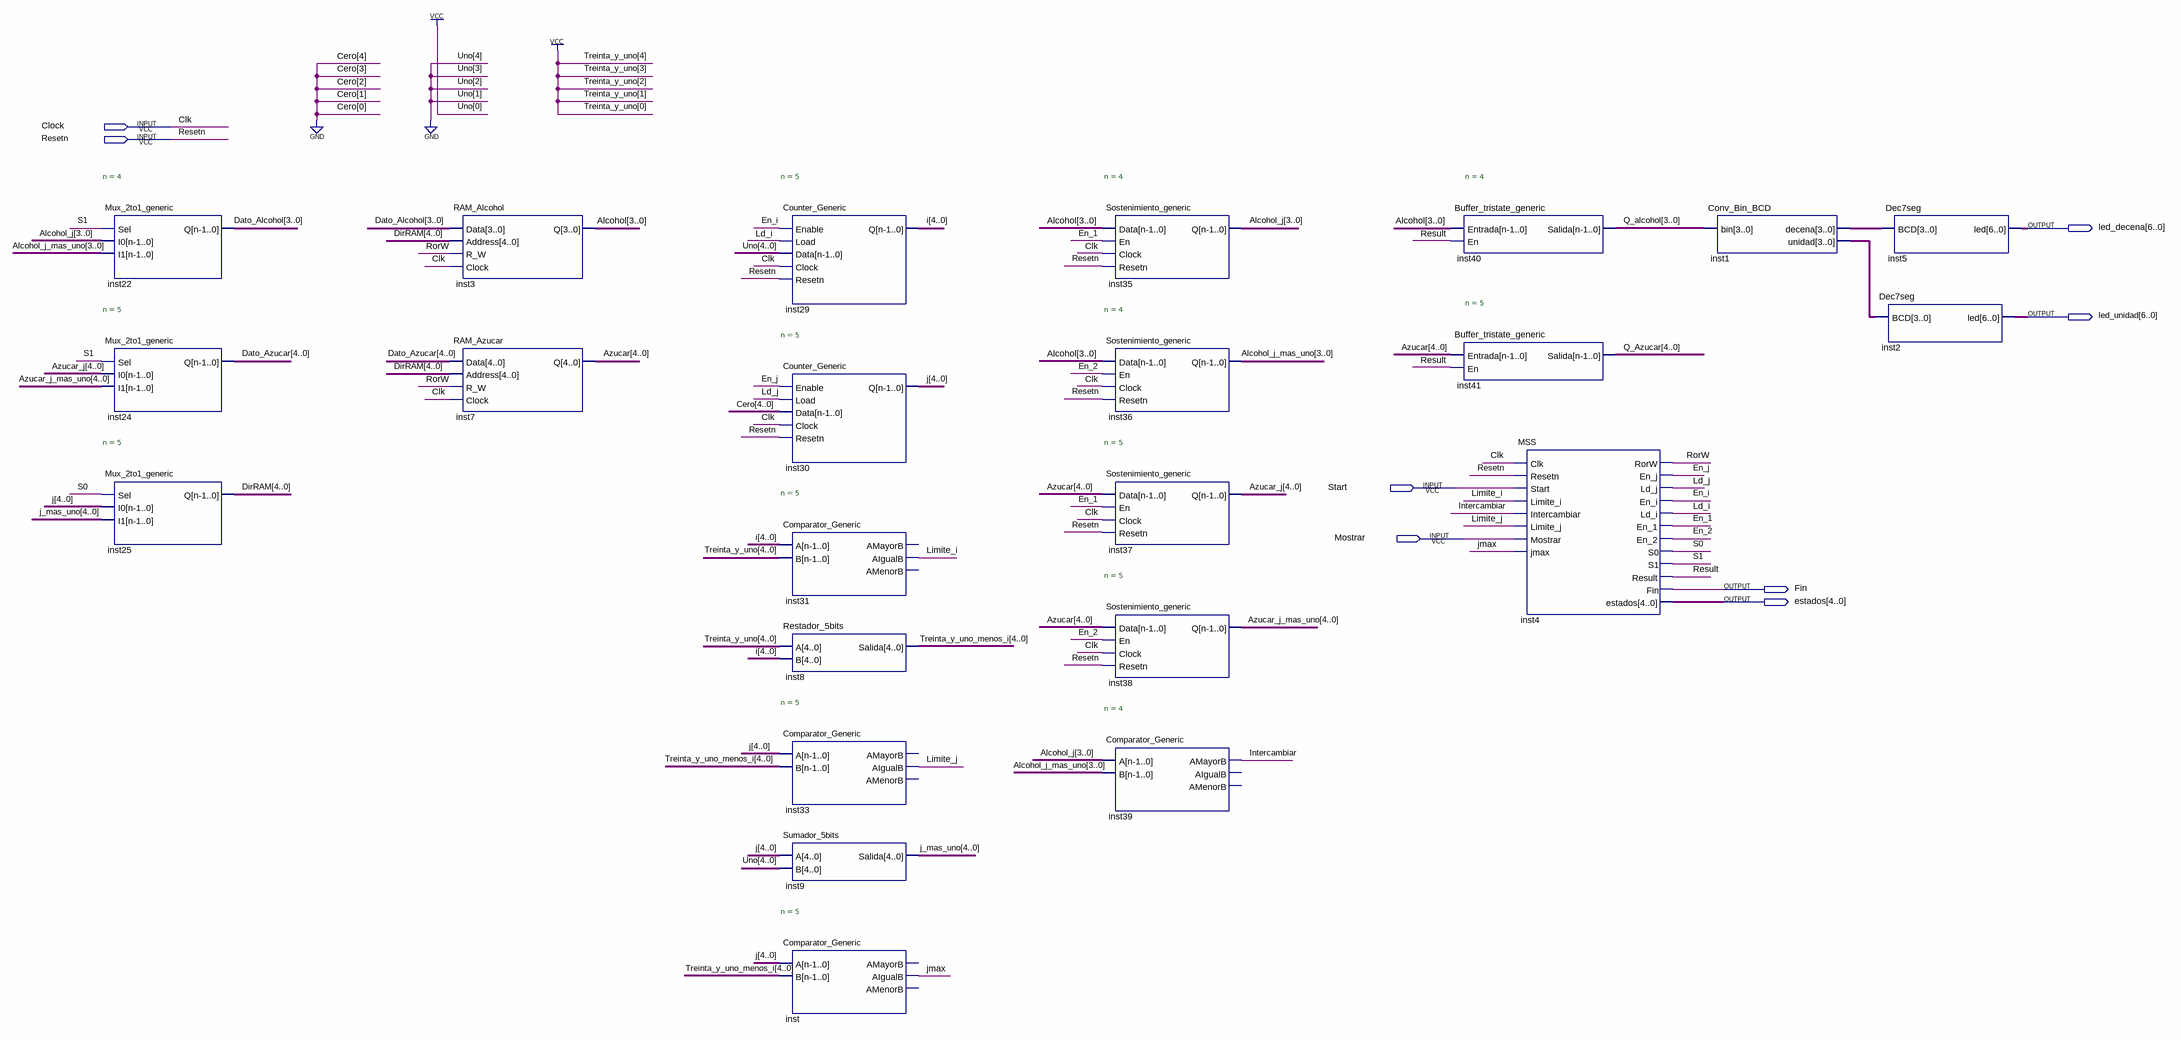
[diagram p0: schematic sheet]
// Quartus schematic Diagram.bdf as structural Verilog: 23 symbols, 8 pins
module Diagram (
  input  Clock,
  input  Resetn,
  input  Start,
  input  Mostrar,
  output [6:0] led_decena,
  output [6:0] led_unidad,
  output Fin,
  output [4:0] estados
);

  wire En_1, En_2, En_i, En_j, Intercambiar, jmax, Ld_i, Ld_j, Limite_i, Limite_j, Result, RorW, S0, S1;
  wire [3:0] Alcohol, Alcohol_j, Alcohol_j_mas_uno, Dato_Alcohol, inst1_decena, inst1_unidad, Q_alcohol;
  wire [4:0] Azucar, Azucar_j, Azucar_j_mas_uno, Dato_Azucar, DirRAM, i, j, j_mas_uno, Q_Azucar,
       Treinta_y_uno_menos_i;

  Mux_2to1_generic #(.n(4)) inst22 (.Sel(S1), .I0(Alcohol_j), .I1(Alcohol_j_mas_uno), .Q(Dato_Alcohol));
  Mux_2to1_generic #(.n(5)) inst24 (.Sel(S1), .I0(Azucar_j), .I1(Azucar_j_mas_uno), .Q(Dato_Azucar));
  Mux_2to1_generic #(.n(5)) inst25 (.Sel(S0), .I0(j), .I1(j_mas_uno), .Q(DirRAM));
  RAM_Alcohol inst3 (.Data(Dato_Alcohol), .Address(DirRAM), .R_W(RorW), .Clock(Clock), .Q(Alcohol));
  RAM_Azucar inst7 (.Data(Dato_Azucar), .Address(DirRAM), .R_W(RorW), .Clock(Clock), .Q(Azucar));
  Counter_Generic #(.n(5)) inst29 (.Enable(En_i), .Load(Ld_i), .Data(5'b00001), .Clock(Clock), .Resetn(Resetn), .Q(i));
  Counter_Generic #(.n(5)) inst30 (.Enable(En_j), .Load(Ld_j), .Data({5{1'b0}}), .Clock(Clock), .Resetn(Resetn), .Q(j));
  Comparator_Generic #(.n(5)) inst31 (.A(i), .B({5{1'b1}}), .AIgualB(Limite_i));  // open: AMayorB, AMenorB
  Restador_5bits inst8 (.A({5{1'b1}}), .B(i), .Salida(Treinta_y_uno_menos_i));
  Comparator_Generic #(.n(5)) inst33 (.A(j), .B(Treinta_y_uno_menos_i), .AIgualB(Limite_j));  // open: AMayorB, AMenorB
  Sumador_5bits inst9 (.A(j), .B(5'b00001), .Salida(j_mas_uno));
  Comparator_Generic #(.n(5)) inst (.A(j), .B(Treinta_y_uno_menos_i), .AIgualB(jmax));  // open: AMayorB, AMenorB
  Sostenimiento_generic #(.n(4)) inst35 (.Data(Alcohol), .En(En_1), .Clock(Clock), .Resetn(Resetn), .Q(Alcohol_j));
  Sostenimiento_generic #(.n(4)) inst36 (
    .Data(Alcohol), .En(En_2), .Clock(Clock), .Resetn(Resetn), .Q(Alcohol_j_mas_uno));
  Sostenimiento_generic #(.n(5)) inst37 (.Data(Azucar), .En(En_1), .Clock(Clock), .Resetn(Resetn), .Q(Azucar_j));
  Sostenimiento_generic #(.n(5)) inst38 (
    .Data(Azucar), .En(En_2), .Clock(Clock), .Resetn(Resetn), .Q(Azucar_j_mas_uno));
  Comparator_Generic #(.n(4)) inst39 (
    .A(Alcohol_j), .B(Alcohol_j_mas_uno), .AMayorB(Intercambiar));  // open: AIgualB, AMenorB
  Buffer_tristate_generic #(.n(4)) inst40 (.Entrada(Alcohol), .En(Result), .Salida(Q_alcohol));
  Buffer_tristate_generic #(.n(5)) inst41 (.Entrada(Azucar), .En(Result), .Salida(Q_Azucar));
  MSS inst4 (
    .Clk(Clock), .Resetn(Resetn), .Start(Start), .Limite_i(Limite_i), .Intercambiar(Intercambiar),
    .Limite_j(Limite_j), .Mostrar(Mostrar), .jmax(jmax), .RorW(RorW), .En_j(En_j), .Ld_j(Ld_j), .En_i(En_i),
    .Ld_i(Ld_i), .En_1(En_1), .En_2(En_2), .S0(S0), .S1(S1), .Result(Result), .Fin(Fin), .estados(estados));
  Conv_Bin_BCD inst1 (.bin(Q_alcohol), .decena(inst1_decena), .unidad(inst1_unidad));
  Dec7seg inst5 (.BCD(inst1_decena), .led(led_decena));
  Dec7seg inst2 (.BCD(inst1_unidad), .led(led_unidad));

  // Other names for the same wires on the sheet: Clk = Clock
endmodule
